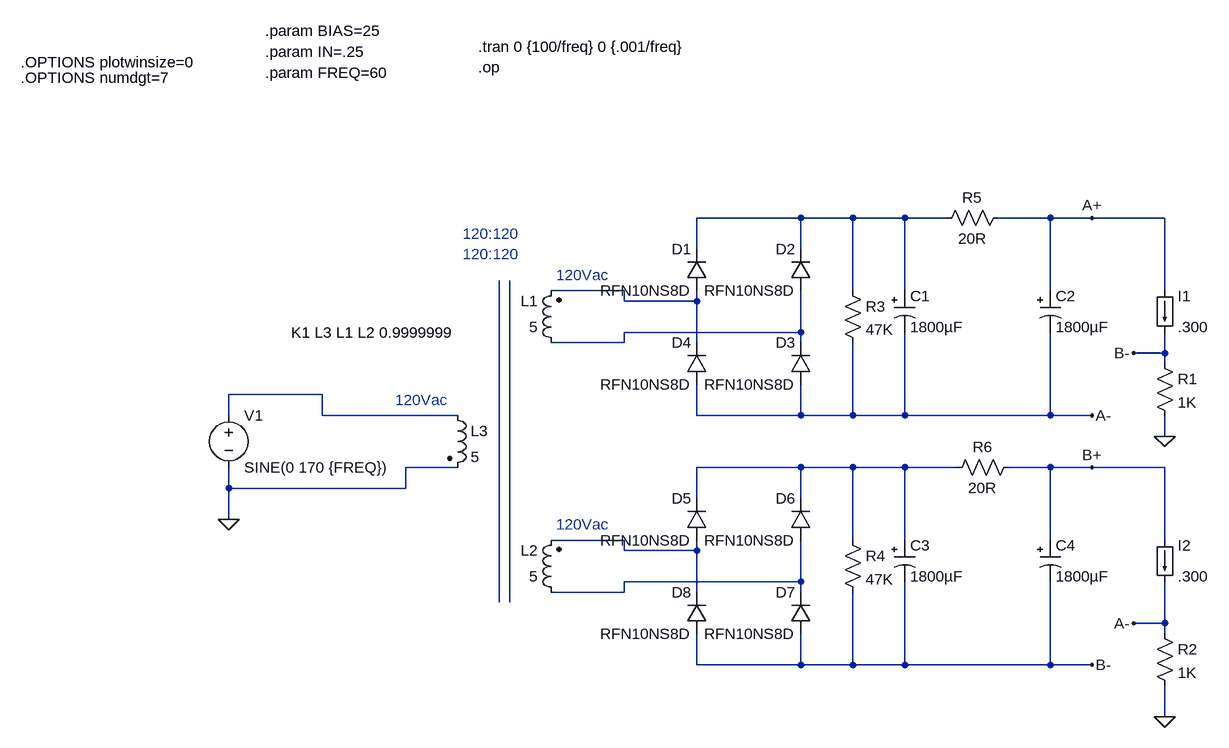
[diagram p0: schematic FPSU power test SIM.asc]
FPSU power test SIM.asc, the LTspice schematic file:
Version 4
SHEET 1 888 680
WIRE 240 -256 80 -256
WIRE 320 -256 240 -256
WIRE 400 -256 320 -256
WIRE 464 -256 400 -256
WIRE 624 -256 544 -256
WIRE 688 -256 624 -256
WIRE 800 -256 688 -256
WIRE 80 -208 80 -256
WIRE 240 -208 240 -256
WIRE -32 -144 -144 -144
WIRE 320 -144 320 -256
WIRE 400 -144 400 -256
WIRE 624 -144 624 -256
WIRE 800 -144 800 -256
WIRE -32 -128 -32 -144
WIRE 80 -128 80 -144
WIRE 80 -128 -32 -128
WIRE 240 -80 240 -144
WIRE 240 -80 -32 -80
WIRE -32 -64 -32 -80
WIRE -32 -64 -144 -64
WIRE 80 -64 80 -128
WIRE 240 -64 240 -80
WIRE 800 -48 800 -80
WIRE 800 -48 752 -48
WIRE 800 -32 800 -48
WIRE -496 16 -640 16
WIRE -640 48 -640 16
WIRE -496 48 -496 16
WIRE -288 48 -496 48
WIRE 80 48 80 0
WIRE 240 48 240 0
WIRE 240 48 80 48
WIRE 320 48 320 -64
WIRE 320 48 240 48
WIRE 400 48 400 -80
WIRE 400 48 320 48
WIRE 624 48 624 -80
WIRE 624 48 400 48
WIRE 688 48 624 48
WIRE 800 80 800 48
WIRE -288 128 -368 128
WIRE 240 128 80 128
WIRE 320 128 240 128
WIRE 400 128 320 128
WIRE 480 128 400 128
WIRE 624 128 560 128
WIRE 688 128 624 128
WIRE 800 128 688 128
WIRE -640 160 -640 128
WIRE -368 160 -368 128
WIRE -368 160 -640 160
WIRE 80 176 80 128
WIRE 240 176 240 128
WIRE -640 208 -640 160
WIRE -32 240 -144 240
WIRE 320 240 320 128
WIRE 400 240 400 128
WIRE 624 240 624 128
WIRE 800 240 800 128
WIRE -32 256 -32 240
WIRE 80 256 80 240
WIRE 80 256 -32 256
WIRE 240 304 240 240
WIRE 240 304 -32 304
WIRE -32 320 -32 304
WIRE -32 320 -144 320
WIRE 80 320 80 256
WIRE 240 320 240 304
WIRE -224 336 -224 -160
WIRE -208 336 -208 -160
WIRE 800 368 800 304
WIRE 800 368 752 368
WIRE 800 384 800 368
WIRE 80 432 80 384
WIRE 240 432 240 384
WIRE 240 432 80 432
WIRE 320 432 320 320
WIRE 320 432 240 432
WIRE 400 432 400 304
WIRE 400 432 320 432
WIRE 624 432 624 304
WIRE 624 432 400 432
WIRE 688 432 624 432
WIRE 800 512 800 464
FLAG 688 -256 A+
FLAG 688 48 A-
FLAG 688 128 B+
FLAG 688 432 B-
FLAG 800 80 0
FLAG 800 512 0
FLAG 752 368 A-
FLAG 752 -48 B-
FLAG -640 208 0
SYMBOL diode 96 -144 R180
WINDOW 0 24 64 Left 2
WINDOW 3 24 0 Left 2
SYMATTR InstName D1
SYMATTR Value RFN10NS8D
SYMBOL polcap 384 -144 R0
SYMATTR InstName C1
SYMATTR Value 1800µF
SYMATTR SpiceLine V=200 Irms=4.32 Rser=.12
SYMBOL ind2 -128 -48 R180
WINDOW 0 36 80 Left 2
WINDOW 3 36 40 Left 2
SYMATTR InstName L1
SYMATTR Value 5
SYMATTR SpiceLine Rser=8
SYMBOL ind2 -128 336 R180
WINDOW 0 36 80 Left 2
WINDOW 3 36 40 Left 2
SYMATTR InstName L2
SYMATTR Value 5
SYMATTR SpiceLine Rser=8
SYMBOL ind2 -304 32 R0
SYMATTR InstName L3
SYMATTR Value 5
SYMATTR SpiceLine Rser=4
SYMBOL diode 256 -144 R180
WINDOW 0 24 64 Left 2
WINDOW 3 24 0 Left 2
SYMATTR InstName D2
SYMATTR Value RFN10NS8D
SYMBOL diode 256 0 R180
WINDOW 0 24 64 Left 2
WINDOW 3 24 0 Left 2
SYMATTR InstName D3
SYMATTR Value RFN10NS8D
SYMBOL diode 96 0 R180
WINDOW 0 24 64 Left 2
WINDOW 3 24 0 Left 2
SYMATTR InstName D4
SYMATTR Value RFN10NS8D
SYMBOL diode 96 240 R180
WINDOW 0 24 64 Left 2
WINDOW 3 24 0 Left 2
SYMATTR InstName D5
SYMATTR Value RFN10NS8D
SYMBOL diode 256 240 R180
WINDOW 0 24 64 Left 2
WINDOW 3 24 0 Left 2
SYMATTR InstName D6
SYMATTR Value RFN10NS8D
SYMBOL diode 256 384 R180
WINDOW 0 24 64 Left 2
WINDOW 3 24 0 Left 2
SYMATTR InstName D7
SYMATTR Value RFN10NS8D
SYMBOL diode 96 384 R180
WINDOW 0 24 64 Left 2
WINDOW 3 24 0 Left 2
SYMATTR InstName D8
SYMATTR Value RFN10NS8D
SYMBOL load 784 -144 R0
WINDOW 123 0 0 Left 0
WINDOW 39 0 0 Left 0
SYMATTR InstName I1
SYMATTR Value .300
SYMBOL load 784 240 R0
WINDOW 123 0 0 Left 0
WINDOW 39 0 0 Left 0
SYMATTR InstName I2
SYMATTR Value .300
SYMBOL res 784 -48 R0
SYMATTR InstName R1
SYMATTR Value 1K
SYMBOL res 784 368 R0
SYMATTR InstName R2
SYMATTR Value 1K
SYMBOL voltage -640 32 R0
WINDOW 123 0 0 Left 0
WINDOW 39 0 0 Left 0
SYMATTR InstName V1
SYMATTR Value SINE(0 170 {FREQ})
SYMBOL res 304 -160 R0
SYMATTR InstName R3
SYMATTR Value 47K
SYMBOL res 304 224 R0
SYMATTR InstName R4
SYMATTR Value 47K
SYMBOL res 560 -272 R90
WINDOW 0 0 56 VBottom 2
WINDOW 3 32 56 VTop 2
SYMATTR InstName R5
SYMATTR Value 20R
SYMBOL res 576 112 R90
WINDOW 0 0 56 VBottom 2
WINDOW 3 32 56 VTop 2
SYMATTR InstName R6
SYMATTR Value 20R
SYMBOL polcap 608 -144 R0
SYMATTR InstName C2
SYMATTR Value 1800µF
SYMATTR SpiceLine V=200 Irms=4.32 Rser=.12
SYMBOL polcap 384 240 R0
SYMATTR InstName C3
SYMATTR Value 1800µF
SYMATTR SpiceLine V=200 Irms=4.32 Rser=.12
SYMBOL polcap 608 240 R0
SYMATTR InstName C4
SYMATTR Value 1800µF
SYMATTR SpiceLine V=200 Irms=4.32 Rser=.12
TEXT -136 -168 Left 2 ;120Vac
TEXT -136 216 Left 2 ;120Vac
TEXT -384 24 Left 2 ;120Vac
TEXT -280 -232 Left 2 ;120:120\n120:120
TEXT -544 -80 Left 2 !K1 L3 L1 L2 0.9999999
TEXT -960 -496 Left 2 !.OPTIONS plotwinsize=0
TEXT -960 -472 Left 2 !.OPTIONS numdgt=7
TEXT -584 -480 Left 2 !.param FREQ=60
TEXT -584 -512 Left 2 !.param IN=.25
TEXT -256 -520 Left 2 !.tran 0 {100/freq} 0 {.001/freq}
TEXT -256 -488 Left 2 !.op
TEXT -584 -544 Left 2 !.param BIAS=25

The netlist it stands for:
* FPSU power test SIM.asc
D1 N002 N001 RFN10NS8D
C1 N001 A- 1800µF V=200 Irms=4.32 Rser=.12
L1 N003 N002 5 Rser=8
L2 N007 N006 5 Rser=8
L3 N004 0 5 Rser=4
D2 N003 N001 RFN10NS8D
D3 A- N003 RFN10NS8D
D4 A- N002 RFN10NS8D
D5 N006 N005 RFN10NS8D
D6 N007 N005 RFN10NS8D
D7 B- N007 RFN10NS8D
D8 B- N006 RFN10NS8D
I1 A+ B- .300
I2 B+ A- .300
R1 B- 0 1K
R2 A- 0 1K
V1 N004 0 SINE(0 170 {FREQ})
R3 N001 A- 47K
R4 N005 B- 47K
R5 A+ N001 20R
R6 B+ N005 20R
C2 A+ A- 1800µF V=200 Irms=4.32 Rser=.12
C3 N005 B- 1800µF V=200 Irms=4.32 Rser=.12
C4 B+ B- 1800µF V=200 Irms=4.32 Rser=.12
.model D D
.lib standard.dio
* 120Vac
* 120Vac
* 120Vac
* 120:120
* 120:120
K1 L3 L1 L2 0.9999999
.OPTIONS plotwinsize=0
.OPTIONS numdgt=7
.param FREQ=60
.param IN=.25
.tran 0 {100/freq} 0 {.001/freq}
.op
.param BIAS=25
.backanno
.end